# Altium schematic sheet Sheet_1.schdoc
size 78 x 44 mm
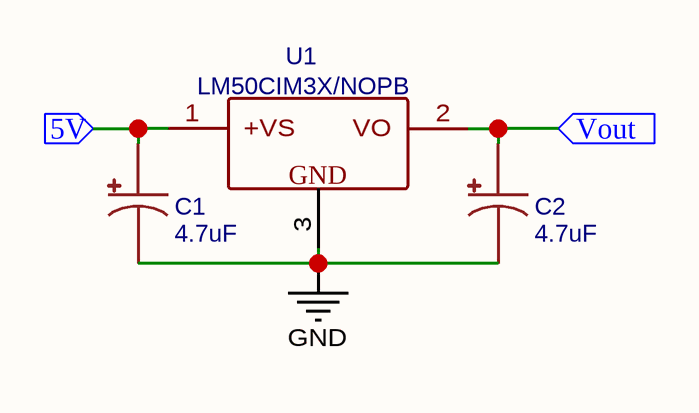
[diagram p0: Sheet_1.schdoc]

## Parts
C1  4.7uF  [CASE-A_3216]
C2  4.7uF  [CASE-A_3216]
U1  LM50CIM3X/NOPB  [SOT-23-3_L2.9-W1.3-P1.90-LS2.4-BR]

## Ports
5V (in), Vout (in)

## Nets
GND: C1.2 C2.2 U1.3(GND)
5V: C1.1 U1.1(+VS) ; port 5V
Vout: C2.1 U1.2(VO) ; port Vout

## Library data of the parts
C1 C2 = 4.7uF: Manufacturer: KEMET(基美); Manufacturer Part: T491A475M025AT; nameAlias: Value; Contributor: LCSC; Supplier: LCSC; Supplier Part: C122269; JLCPCB Part Class: Extended Part; spicePre: C; spiceSymbolName: T491A475M025AT
U1 = LM50CIM3X/NOPB: Manufacturer: TI(德州仪器); Supplier: LCSC; Manufacturer Part: LM50CIM3X/NOPB; Supplier Part: C48600; JLCPCB Part Class: Extended Part; spicePre: U; spiceSymbolName: LM50CIM3X/NOPB